# EAGLE board sinobit (EAGLE 6.1), part 1 of 2
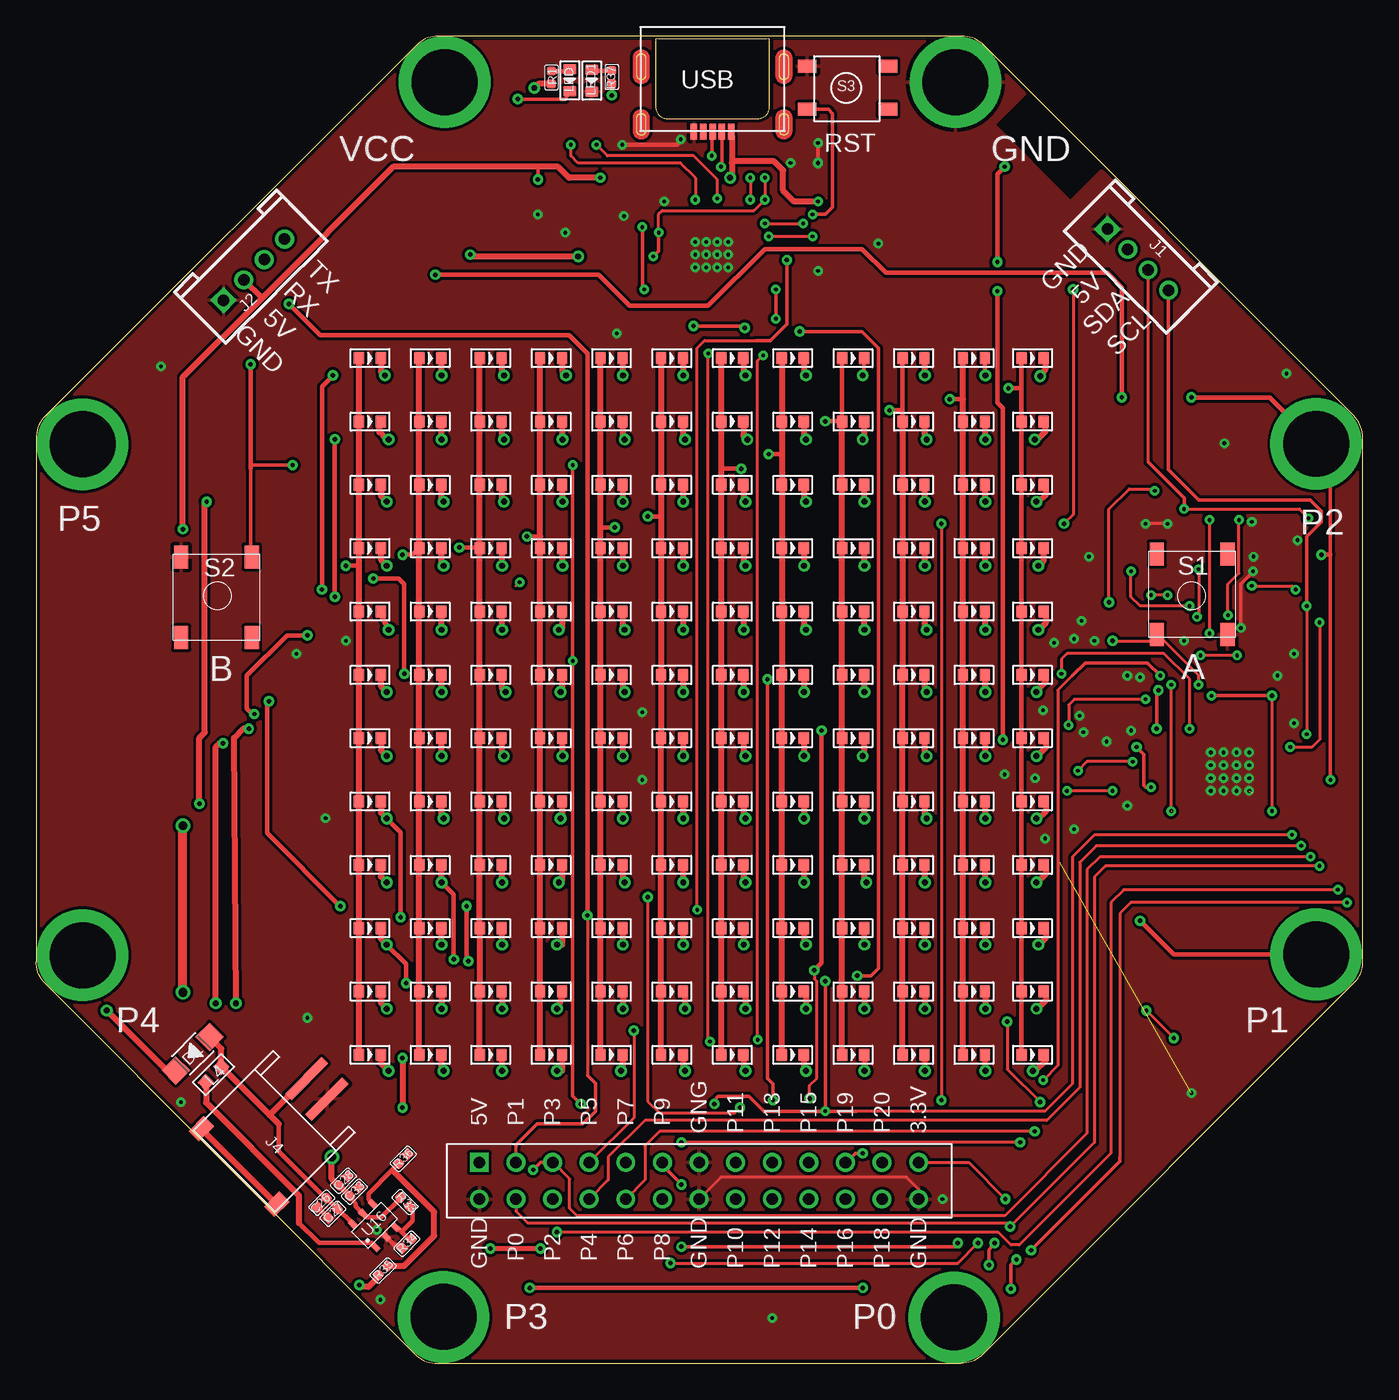
[diagram p2: board, top side]
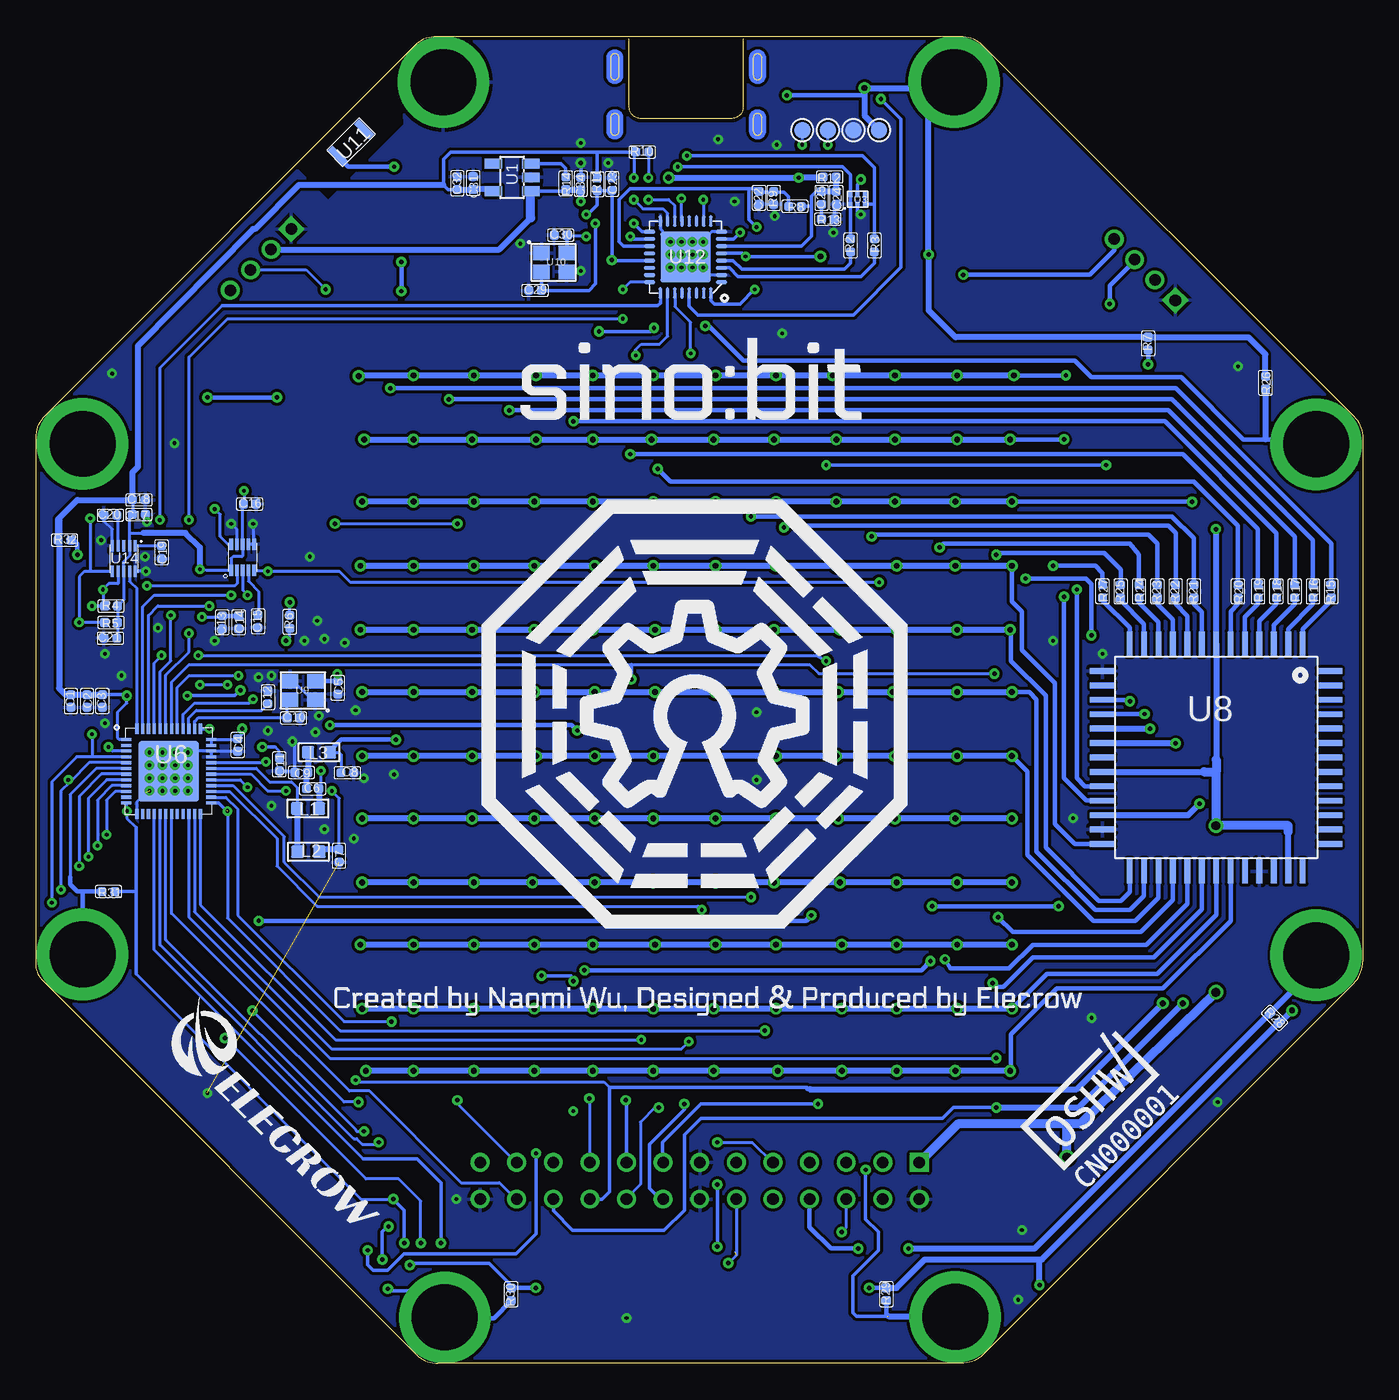
[diagram p3: board, bottom side, seen from below]

Size 92.05 x 92.1 mm. Coordinates in mm from the lower left corner, seen from the top.
Outline: 65.68,0.63 91.53,26.5 arc45 92.05,27.76 92.05,64.23 arc45 91.42,65.76 65.76,91.47 arc45 64.23,92.1 27.92,92.1 arc45 26.39,91.47 0.63,65.73 arc45 0,64.21 0,27.89 arc45 0.63,26.37 26.32,0.63 arc45 27.85,0 64.15,0 arc45 65.68,0.63
Copper layers (1*16): Top 0.035mm / dielectric 1.5mm / Bottom 0.035mm
Design rules: minimum track width 8mil, minimum drill 8mil, track to track 8mil, track to pad 8mil, pad to pad 8mil, via to via 8mil, smd to smd 0mil, copper to edge 10mil, drill to drill 8mil, minimum pad ring 10mil, minimum via ring 8mil, stop-mask expansion 4mil, vias tented up to drill 100mil, thermal gap 10mil
Net classes: 0 default: width 0.003 mm, drill 0.254 mm, clearance 0.152 mm

## Footprints (pad centres in the part's own frame; a part is rotated, then mirrored left to right if it is on the bottom)
C0402 = smd 0.635 x 0.635: 1 -0.445,0; 2 0.445,0
SOD123 = smd 1.397 x 1.397: + -1.651,0; - 1.651,0
D0603 = smd 0.762 x 0.889: + -0.762,0; - 0.762,0
2.0_1X4 = drill 0.8 pad 1.27 square: 1 -3,0 | drill 0.8 pad 1.27: 2 -1,0; 3 1,0; 4 3,0
JST-SMD-2.0-90D = smd 1 x 1.5: 3 3.7,-2.54; 4 -3.7,-2.54 | smd 0.635 x 3.6: + -1,5.08; - 1,5.08
L0603 = smd 0.889 x 0.889: 1 -0.762,0; 2 0.762,0
R0402 = smd 0.635 x 0.635: 1 -0.445,0; 2 0.445,0
SWITCH = smd 1.6 x 1: 1 -2.7,2.4; 2 2.9,2.4; 3 -2.7,-2.5; 4 2.9,-2.5
SWITC4.5X4.5 = smd 1.3 x 0.9: P$1 -0.5,3.8; P$2 -0.5,0.8; P$3 5.1,0.8; P$4 5.1,3.8
TP_4545 = smd 1.143 x 1.143: T 0,0
SOT23-5 = smd 0.69 x 1.2: 1 -0.95,-1.3; 2 0,-1.3; 3 0.95,-1.3; 4 0.95,1.3; 5 -0.95,1.3
MAG3110 = smd 0.8 x 0.22: P1 -0.816,0.846; P2 -0.816,0.446; P3 -0.816,0.046; P4 -0.816,-0.354; P5 -0.816,-0.754; P6 0.984,-0.754; P7 0.984,-0.354; P8 0.984,0.046; P9 0.984,0.446; P10 0.984,0.846
PRTR5V0U2F_SOT886 = smd 0.325 x 0.27: P1 -0.3,0.5; P2 -0.3,0; P3 -0.3,-0.5; P4 0.375,-0.5; P5 0.375,0; P6 0.375,0.5
NRF51822 = smd 0.7 x 0.22: 1 -2.95,2; 2 -2.95,1.6; 3 -2.95,1.2; 4 -2.95,0.8; 5 -2.95,0.4; 6 -2.95,0; 7 -2.95,-0.4; 8 -2.95,-0.8; 9 -2.95,-1.2; 10 -2.95,-1.6; 11 -2.95,-2; 12 -2.95,-2.4; 25 2.95,-2.4; 26 2.95,-2; 27 2.95,-1.6; 28 2.95,-1.2; 29 2.95,-0.8; 30 2.95,-0.4; 31 2.95,0; 32 2.95,0.4; 33 2.95,0.8; 34 2.95,1.2; 35 2.95,1.6; 36 2.95,2 | smd 0.22 x 0.7: 13 -2.2,-3.15; 14 -1.8,-3.15; 15 -1.4,-3.15; 16 -1,-3.15; 17 -0.6,-3.15; 18 -0.2,-3.15; 19 0.2,-3.15; 20 0.6,-3.15; 21 1,-3.15; 22 1.4,-3.15; 23 1.8,-3.15; 24 2.2,-3.15; 37 2.2,2.75; 38 1.8,2.75; 39 1.4,2.75; 40 1,2.75; 41 0.6,2.75; 42 0.2,2.75; 43 -0.2,2.75; 44 -0.6,2.75; 45 -1,2.75; 46 -1.4,2.75; 47 -1.8,2.75; 48 -2.2,2.75 | smd 4.2 x 4.2: P$14 0,-0.2
HT1632C = smd 0.4 x 1.7: P$8 -5.35,-7.25; P$9 -4.35,-7.25; P$10 -3.35,-7.25; P$11 -2.35,-7.25; P$12 -1.35,-7.25; P$13 -0.35,-7.25; P$14 0.65,-7.25; P$15 1.65,-7.25; P$16 2.65,-7.25; P$17 3.65,-7.25; P$18 4.65,-7.25; P$19 5.65,-7.25; P$20 6.65,-7.25; P$34 -5.35,8.55; P$35 -4.35,8.55; P$36 -3.35,8.55; P$37 -2.35,8.55; P$38 -1.35,8.55; P$39 -0.35,8.55; P$40 0.65,8.55; P$41 1.65,8.55; P$42 2.65,8.55; P$43 3.65,8.55; P$44 4.65,8.55; P$45 5.65,8.55; P$46 6.65,8.55 | smd 1.7 x 0.4: P$21 8.55,-5.35; P$22 8.55,-4.35; P$23 8.55,-3.35; P$24 8.55,-2.35; P$25 8.55,-1.35; P$26 8.55,-0.35; P$27 8.55,0.65; P$28 8.55,1.65; P$29 8.55,2.65; P$30 8.55,3.65; P$31 8.55,4.65; P$32 8.55,5.65; P$33 8.55,6.65; P$47 -7.25,-5.35; P$48 -7.25,-4.35; P$49 -7.25,-3.35; P$50 -7.25,-2.35; P$51 -7.25,-1.35; P$52 -7.25,-0.35; P$53 -7.25,0.65; P$54 -7.25,1.65; P$55 -7.25,2.65; P$56 -7.25,3.65; P$57 -7.25,4.65; P$58 -7.25,5.65; P$59 -7.25,6.65
16MHZ2520 = smd 1.15 x 1: 1 2.6,0; 2 4.35,0; 3 4.35,1.3; 4 2.6,1.3
TIANXIAN = smd 0.5 x 1.47: P$1 0.3,0.8; P$2 2.9,0.8
MKL26Z168VFM4 = smd 0.8 x 0.27: 1 -2.6,1.75; 2 -2.6,1.25; 3 -2.6,0.75; 4 -2.6,0.25; 5 -2.6,-0.25; 6 -2.6,-0.75; 7 -2.6,-1.25; 8 -2.6,-1.75; 17 2.4,-1.75; 18 2.4,-1.25; 19 2.4,-0.75; 20 2.4,-0.25; 21 2.4,0.25; 22 2.4,0.75; 23 2.4,1.25; 24 2.4,1.75 | smd 0.27 x 0.8: 9 -1.85,-2.5; 10 -1.35,-2.5; 11 -0.85,-2.5; 12 -0.35,-2.5; 13 0.15,-2.5; 14 0.65,-2.5; 15 1.15,-2.5; 16 1.65,-2.5; 25 1.65,2.5; 26 1.15,2.5; 27 0.65,2.5; 28 0.15,2.5; 29 -0.35,2.5; 30 -0.85,2.5; 32 -1.85,2.5 | smd 0.26 x 0.8: 31 -1.35,2.5 | smd 3.5 x 3.5: P$9 -0.1,0
MMA8653FC = smd 0.8 x 0.26: 6 1.92,0.2; 7 1.92,0.6; 8 1.92,1; 9 1.92,1.4; 10 1.92,1.8; P1 0.1,1.8; P2 0.1,1.4; P3 0.1,1; P4 0.1,0.6; P5 0.1,0.2
PS7516 = smd 0.4 x 0.6: P1 -1.07,-1.14; P2 -0.05,-1.14; P3 0.9,-1.14; P4 0.9,1.14; P5 -0.05,1.14; P6 -1.07,1.14
26PIN = drill 0.8 square: P$1 0,0 | drill 0.8: P$2 2.54,0; P$3 5.08,0; P$4 7.62,0; P$5 10.16,0; P$6 12.7,0; P$7 15.24,0; P$8 17.78,0; P$9 20.32,0; P$10 22.86,0; P$11 25.4,0; P$12 27.94,0; P$13 30.48,0; P$14 30.48,-2.54; P$15 27.94,-2.54; P$16 25.4,-2.54; P$17 22.86,-2.54; P$18 20.32,-2.54; P$19 17.78,-2.54; P$20 15.24,-2.54; P$21 12.7,-2.54; P$22 10.16,-2.54; P$23 7.62,-2.54; P$24 5.08,-2.54; P$25 2.54,-2.54; P$26 0,-2.54
焊盘1 = drill 4.572 pad 6.35: P$1 0,0
47642-0001 = smd 0.45 x 1.1: 1 -1.3,6.47; 2 -0.65,6.47; 3 0,6.47; 4 0.65,6.47; 5 1.3,6.47

## Placement (x,y rotation side)
C1  4.7uf  [C0402]  89.63,45.96 90 bottom
C2  100nf  [C0402]  88.52,45.96 90 bottom
C3  100nf  [C0402]  87.45,45.96 90 bottom
C4  100nf  [C0402]  78.06,42.91 90 bottom
C5  12pF  [C0402]  71.12,46.88 270 bottom
C6  2.2pf  [C0402]  72.86,39.87 180 bottom
C7  2.2nf  [C0402]  71.03,35.22 270 bottom
C8  1.5pf  [C0402]  70.45,40.98 0 bottom
C9  0.8pf  [C0402]  73.65,41.01 180 bottom
C10  12pF  [C0402]  74.18,44.78 0 bottom
C11  47nF  [C0402]  75.18,41.57 270 bottom
C12  100nF  [C0402]  75.95,46.21 90 bottom
C13  100nF  [C0402]  79.13,51.42 90 bottom
C14  1uF  [C0402]  77.99,51.42 90 bottom
C15  100nF  [C0402]  76.65,51.5 90 bottom
C16  100nF  [C0402]  77.23,59.63 0 bottom
C17  100nF  [C0402]  84.91,58.9 180 bottom
C18  1uF  [C0402]  84.91,59.92 180 bottom
C19  100nF  [C0402]  83.34,56.29 270 bottom
C20  100nF  [C0402]  86.89,58.85 0 bottom
C21  100nF  [C0402]  86.89,50.32 0 bottom
C22  100nF  [C0402]  41.88,80.87 90 bottom
C23  100nF  [C0402]  52.1,81.84 270 bottom
C24  100nF  [C0402]  36.53,80.87 90 bottom
C25  1uF  [C0402]  37.54,80.87 90 bottom
C26  0.1uF  [C0402]  19.84,11.15 45 top
C27  10uF  [C0402]  20.6,10.39 45 top
C28  0.1uF  [C0402]  21.34,12.67 225 top
C29  6.8pF  [C0402]  57.43,74.45 0 bottom
C30  6.8pF  [C0402]  55.65,78.28 0 bottom
C31  1uF  [C0402]  61.73,81.9 270 bottom
C32  10uF  [C0402]  62.81,81.89 270 bottom
C33  10uF  [C0402]  22.1,11.91 225 top
C34  10uF  [C0402]  54.25,81.85 270 bottom
D1  MBR0520  [SOD123]  10.87,21.49 225 top
E$1  [文字]  71.78,23.47 0 bottom
E$2  [SINOBIT2]  59.46,64.87 0 bottom
E$3  [ELECEOW]  83.97,22.45 315 bottom
E$4  [SINOBIT编号]  19.08,11.66 45 bottom
E$5  [XXX]  61.11,30.2 0 bottom
EB  RED  [D0603]  23.16,69.75 0 top
EB1  RED  [D0603]  23.16,65.35 0 top
EB2  RED  [D0603]  23.16,60.96 0 top
EB3  RED  [D0603]  23.16,56.57 0 top
EB4  RED  [D0603]  23.16,52.17 0 top
EB5  RED  [D0603]  23.16,47.78 0 top
EB6  RED  [D0603]  23.16,43.38 0 top
EB7  RED  [D0603]  23.16,38.99 0 top
EB8  RED  [D0603]  23.16,34.59 0 top
EB9  RED  [D0603]  23.16,30.2 0 top
EB10  RED  [D0603]  23.16,25.81 0 top
EB11  RED  [D0603]  23.16,21.41 0 top
EB12  RED  [D0603]  27.36,69.75 0 top
EB13  RED  [D0603]  27.36,65.35 0 top
EB14  RED  [D0603]  27.36,60.96 0 top
EB15  RED  [D0603]  27.36,56.57 0 top
EB16  RED  [D0603]  27.36,52.17 0 top
EB17  RED  [D0603]  27.36,47.78 0 top
EB18  RED  [D0603]  27.36,43.38 0 top
EB19  RED  [D0603]  27.36,38.99 0 top
EB20  RED  [D0603]  27.36,34.59 0 top
EB21  RED  [D0603]  27.36,30.2 0 top
EB22  RED  [D0603]  27.36,25.81 0 top
EB23  RED  [D0603]  27.36,21.41 0 top
EB24  RED  [D0603]  31.55,69.75 0 top
EB25  RED  [D0603]  31.55,65.35 0 top
EB26  RED  [D0603]  31.55,60.96 0 top
EB27  RED  [D0603]  31.55,56.57 0 top
EB28  RED  [D0603]  31.55,52.17 0 top
EB29  RED  [D0603]  31.55,47.78 0 top
EB30  RED  [D0603]  31.55,43.38 0 top
EB31  RED  [D0603]  31.55,38.99 0 top
EB32  RED  [D0603]  31.55,34.59 0 top
EB33  RED  [D0603]  31.55,30.2 0 top
EB34  RED  [D0603]  31.55,25.81 0 top
EB35  RED  [D0603]  31.55,21.41 0 top
EB36  RED  [D0603]  35.74,69.75 0 top
EB37  RED  [D0603]  35.74,65.35 0 top
EB38  RED  [D0603]  35.74,60.96 0 top
EB39  RED  [D0603]  35.74,56.57 0 top
EB40  RED  [D0603]  35.74,52.17 0 top
EB41  RED  [D0603]  35.74,47.78 0 top
EB42  RED  [D0603]  35.74,43.38 0 top
EB43  RED  [D0603]  35.74,38.99 0 top
EB44  RED  [D0603]  35.74,34.59 0 top
EB45  RED  [D0603]  35.74,30.2 0 top
EB46  RED  [D0603]  35.74,25.81 0 top
EB47  RED  [D0603]  35.74,21.41 0 top
EB48  RED  [D0603]  39.93,69.75 0 top
EB49  RED  [D0603]  39.93,65.35 0 top
EB50  RED  [D0603]  39.93,60.96 0 top
EB51  RED  [D0603]  39.93,56.57 0 top
EB52  RED  [D0603]  39.93,52.17 0 top
EB53  RED  [D0603]  39.93,47.78 0 top
EB54  RED  [D0603]  39.93,43.38 0 top
EB55  RED  [D0603]  39.93,38.99 0 top
EB56  RED  [D0603]  39.93,34.59 0 top
EB57  RED  [D0603]  39.93,30.2 0 top
EB58  RED  [D0603]  39.93,25.81 0 top
EB59  RED  [D0603]  39.93,21.41 0 top
EB60  RED  [D0603]  44.12,69.75 0 top
EB61  RED  [D0603]  44.12,65.35 0 top
EB62  RED  [D0603]  44.12,60.96 0 top
EB63  RED  [D0603]  44.12,56.57 0 top
EB64  RED  [D0603]  44.12,52.17 0 top
EB65  RED  [D0603]  44.12,47.78 0 top
EB66  RED  [D0603]  44.12,43.38 0 top
EB67  RED  [D0603]  44.12,38.99 0 top
EB68  RED  [D0603]  44.12,34.59 0 top
EB69  RED  [D0603]  44.12,30.2 0 top
EB70  RED  [D0603]  44.12,25.81 0 top
EB71  RED  [D0603]  44.12,21.41 0 top
EB72  RED  [D0603]  48.31,69.75 0 top
EB73  RED  [D0603]  48.31,65.35 0 top
EB74  RED  [D0603]  48.31,60.96 0 top
EB75  RED  [D0603]  48.31,56.57 0 top
EB76  RED  [D0603]  48.31,52.17 0 top
EB77  RED  [D0603]  48.31,47.78 0 top
EB78  RED  [D0603]  48.31,43.38 0 top
EB79  RED  [D0603]  48.31,38.99 0 top
EB80  RED  [D0603]  48.31,34.59 0 top
EB81  RED  [D0603]  48.31,30.2 0 top
EB82  RED  [D0603]  48.31,25.81 0 top
EB83  RED  [D0603]  48.31,21.41 0 top
EB84  RED  [D0603]  52.5,69.75 0 top
EB85  RED  [D0603]  52.5,65.35 0 top
EB86  RED  [D0603]  52.5,60.96 0 top
EB87  RED  [D0603]  52.5,56.57 0 top
EB88  RED  [D0603]  52.5,52.17 0 top
EB89  RED  [D0603]  52.5,47.78 0 top
EB90  RED  [D0603]  52.5,43.38 0 top
EB91  RED  [D0603]  52.5,38.99 0 top
EB92  RED  [D0603]  52.5,34.59 0 top
EB93  RED  [D0603]  52.5,30.2 0 top
EB94  RED  [D0603]  52.5,25.81 0 top
EB95  RED  [D0603]  52.5,21.41 0 top
EB96  RED  [D0603]  56.69,69.75 0 top
EB97  RED  [D0603]  56.69,65.35 0 top
EB98  RED  [D0603]  56.69,60.96 0 top
EB99  RED  [D0603]  56.69,56.57 0 top
EB100  RED  [D0603]  56.69,52.17 0 top
EB101  RED  [D0603]  56.69,47.78 0 top
EB102  RED  [D0603]  56.69,43.38 0 top
EB103  RED  [D0603]  56.69,38.99 0 top
EB104  RED  [D0603]  56.69,34.59 0 top
EB105  RED  [D0603]  56.69,30.2 0 top
EB106  RED  [D0603]  56.69,25.81 0 top
EB107  RED  [D0603]  56.69,21.41 0 top
EB108  RED  [D0603]  60.88,69.75 0 top
EB109  RED  [D0603]  60.88,65.35 0 top
EB110  RED  [D0603]  60.88,60.96 0 top
EB111  RED  [D0603]  60.88,56.57 0 top
EB112  RED  [D0603]  60.88,52.17 0 top
EB113  RED  [D0603]  60.88,47.78 0 top
EB114  RED  [D0603]  60.88,43.38 0 top
EB115  RED  [D0603]  60.88,38.99 0 top
EB116  RED  [D0603]  60.88,34.59 0 top
EB117  RED  [D0603]  60.88,30.2 0 top
EB118  RED  [D0603]  60.88,25.81 0 top
EB119  RED  [D0603]  60.88,21.41 0 top
EB120  RED  [D0603]  65.07,69.75 0 top
EB121  RED  [D0603]  65.07,65.35 0 top
EB122  RED  [D0603]  65.07,60.96 0 top
EB123  RED  [D0603]  65.07,56.57 0 top
EB124  RED  [D0603]  65.07,52.17 0 top
EB125  RED  [D0603]  65.07,47.78 0 top
EB126  RED  [D0603]  65.07,43.38 0 top
EB127  RED  [D0603]  65.07,38.99 0 top
EB128  RED  [D0603]  65.07,34.59 0 top
EB129  RED  [D0603]  65.07,30.2 0 top
EB130  RED  [D0603]  65.07,25.81 0 top
EB131  RED  [D0603]  65.07,21.41 0 top
EB132  RED  [D0603]  69.14,69.75 0 top
EB133  RED  [D0603]  69.14,65.35 0 top
EB134  RED  [D0603]  69.14,60.96 0 top
EB135  RED  [D0603]  69.14,56.57 0 top
EB136  RED  [D0603]  69.14,52.17 0 top
EB137  RED  [D0603]  69.14,47.78 0 top
EB138  RED  [D0603]  69.14,43.38 0 top
EB139  RED  [D0603]  69.14,38.99 0 top
EB140  RED  [D0603]  69.14,34.59 0 top
EB141  RED  [D0603]  69.14,30.2 0 top
EB142  RED  [D0603]  69.14,25.81 0 top
EB143  RED  [D0603]  69.14,21.41 0 top
J1  TWIG_2.0  [2.0_1X4]  76.45,76.59 315 top
J2  TWIG_2.0  [2.0_1X4]  15.12,75.89 45 top
J4  [JST-SMD-2.0-90D]  15.88,15.46 315 top
L1  4.7nH  [L0603]  73.18,38.51 180 bottom
L2  10nH  [L0603]  73.15,35.5 0 bottom
L3  3.3nH  [L0603]  72.42,42.41 180 bottom
L4  10uH  [L0603]  12.32,20.04 225 top
LED  blue  [D0603]  37.03,89.03 270 top
LED1  green  [D0603]  38.56,89 270 top
R1  200R  [R0402]  35.76,89.23 90 top
R2  33R  [R0402]  35.53,77.57 90 bottom
R3  33R  [R0402]  33.88,77.57 90 bottom
R4  4K7  [R0402]  86.84,52.55 0 bottom
R5  4k7  [R0402]  86.84,51.41 0 bottom
R6  10K  [R0402]  74.45,51.46 90 bottom
R7  10K  [R0402]  14.88,70.76 90 bottom
R8  6K2  [R0402]  39.4,80.29 180 bottom
R9  10K  [R0402]  40.87,80.87 90 bottom
R10  10K  [R0402]  49.99,84.05 180 bottom
R11  10K  [R0402]  53.11,81.81 90 bottom
R12  10K  [R0402]  36.98,82.32 180 bottom
R13  0R  [R0402]  37.11,79.4 0 bottom
R14  8.1K  [R0402]  55.3,81.88 270 bottom
R15  200R  [R0402]  2.18,53.57 270 bottom
R16  200R  [R0402]  3.45,53.57 270 bottom
R17  200R  [R0402]  4.72,53.57 270 bottom
R18  200R  [R0402]  5.99,53.57 270 bottom
R19  200R  [R0402]  7.26,53.57 270 bottom
R20  200R  [R0402]  8.66,53.57 270 bottom
R21  200R  [R0402]  11.71,53.57 270 bottom
R22  200R  [R0402]  12.98,53.57 270 bottom
R23  200R  [R0402]  14.25,53.57 270 bottom
R24  200R  [R0402]  15.52,53.57 270 bottom
R25  200R  [R0402]  16.79,53.57 270 bottom
R26  2M  [R0402]  6.76,68.05 270 bottom
R27  200R  [R0402]  18.06,53.57 270 bottom
R28  2M  [R0402]  6.12,23.98 135 bottom
R29  2M  [R0402]  33.05,4.8 270 bottom
R30  2M  [R0402]  59.08,4.8 270 bottom
R31  2M  [R0402]  87.02,32.74 180 bottom
R32  2M  [R0402]  90.07,57.12 0 bottom
R33  510k  [R0402]  25.6,11.2 315 top
R34  100K  [R0402]  25.73,8.31 225 top
R35  200  [R0402]  24.08,6.45 225 top
R36  200  [R0402]  25.48,14.2 225 top
R37  200R  [R0402]  39.95,89.26 90 top
S1  SWITCH  [SWITCH]  80.16,53.26 90 top
S2  SWITCH  [SWITCH]  12.57,53.26 270 top
S3  SWITCH4.5X4.5  [SWITC4.5X4.5]  54,86.21 0 top
TP1  [TP_4545]  37.11,85.57 0 bottom
TP2  [TP_4545]  38.89,85.57 0 bottom
TP3  [TP_4545]  35.33,85.57 0 bottom
TP4  [TP_4545]  33.55,85.57 0 bottom
U1  SPX3819  [SOT23-5]  59.02,82.29 90 bottom
U2  [MAG3110]  86,55.93 270 bottom
U3  [PRTR5V0U2F_SOT886]  35.05,80.72 90 bottom
U6  IC_NRF51822_MODULE  [NRF51822]  82.85,41.29 0 bottom
U8  HT1632C_QFP52  [HT1632C]  10.82,42.7 270 bottom
U9  16MHZ2520  [16MHZ2520]  70.08,47.35 180 bottom
U10  16MHZ2520  [16MHZ2520]  59.59,75.74 0 bottom
U11  TIANXIAN  [TIANXIAN]  70.76,83.03 45 bottom
U12  IC_MKL26Z128VFM4  [MKL26Z168VFM4]  47.08,76.77 180 bottom
U14  IC_MMA8653FCR1  [MMA8653FC]  76.71,54.93 90 bottom
U16  PS7516  [PS7516]  23.52,9.63 45 top
U$12  26PIN  [26PIN]  30.76,13.94 0 top
U$35  焊盘1  [焊盘1]  88.82,28.38 0 bottom
U$39  焊盘1  [焊盘1]  88.82,63.8 0 bottom
U$46  焊盘1  [焊盘1]  63.79,88.9 0 bottom
U$48  焊盘1  [焊盘1]  3.23,63.78 0 bottom
U$49  焊盘1  [焊盘1]  3.23,28.32 0 bottom
U$50  焊盘1  [焊盘1]  28.27,3.23 0 bottom
U$51  焊盘1  [焊盘1]  63.69,3.2 0 bottom
U$52  焊盘1  [焊盘1]  28.35,88.9 0 bottom
USB  47642-0001  [47642-0001]  46.94,91.92 180 top